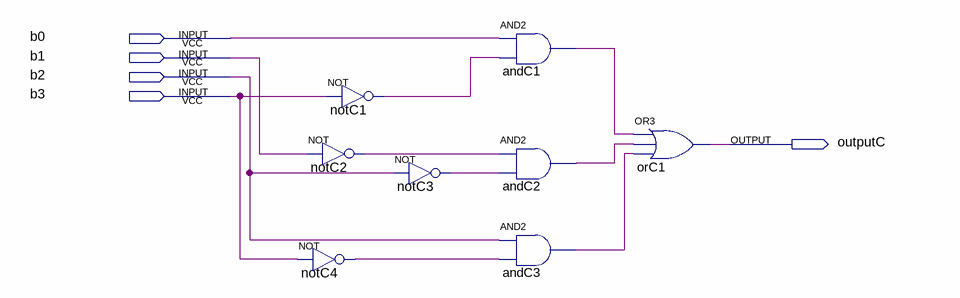
[diagram p0: schematic sheet]
// Quartus schematic c.bdf as structural Verilog: 8 symbols, 5 pins
module c (
  input  b0,
  input  b1,
  input  b2,
  input  b3,
  output outputC
);

  wire andC1_out, andC2_out, andC3_out, notC1_out, notC2_out, notC3_out, notC4_out;

  not notC2 (notC2_out, b1);
  not notC4 (notC4_out, b3);
  not notC1 (notC1_out, b3);
  not notC3 (notC3_out, b2);
  and andC1 (andC1_out, b0, notC1_out);
  and andC2 (andC2_out, notC2_out, notC3_out);
  and andC3 (andC3_out, b2, notC4_out);
  or orC1 (outputC, andC1_out, andC2_out, andC3_out);
endmodule
